# Altium schematic sheet sch_template.SchDoc
size A4
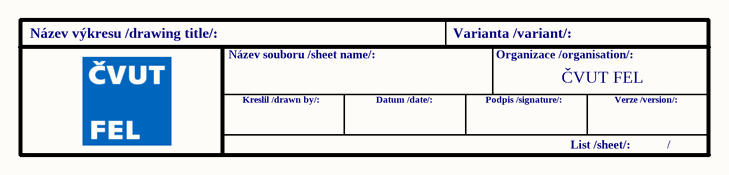
[diagram p0: sch_template.SchDoc]

## Notes on the sheet
- Název výkresu /drawing title/:
- Název souboru /sheet name/:
- Varianta /variant/:
- Organizace /organisation/:
- ČVUT FEL
- Kreslil /drawn by/:
- Datum /date/:
- Podpis /signature/:
- List /sheet/:
- Verze /version/:
- /